# EAGLE design ATtiny prog board with USB (EAGLE 7.3.0)
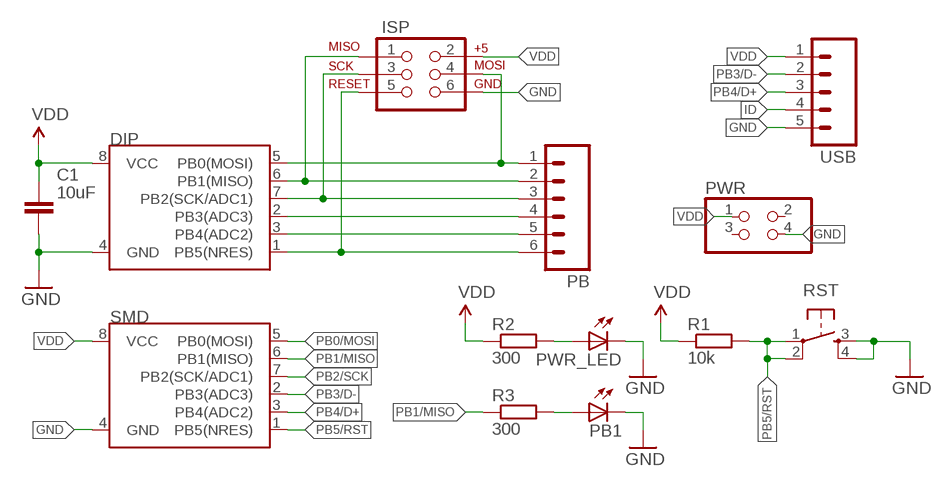
[diagram p0: schematic, sheet 1]

## Parts
C1  10uF  CAPACITOR_NPOL-0805  [C805]
DIP  ATTINY45TINY85-20-DIP  [DIP08]
ISP  AVR_SPI_PRG_6PTH  [2X3]
PB  M06SILK_FEMALE_PTH  [1X06]
PB1  LED-0805  [LED-805]
PWR  PINHD-2X2  [2X02]
PWR_LED  LED-0805  [LED-805]
R1  10k  RESISTOR-0603  [R603]
R2  300  RESISTOR-0603  [R603]
R3  300  RESISTOR-0603  [R603]
RST  TAC_SWITCHPTH  [TACTILE-PTH]
SMD  ATTINY45TINY85-20-SMT  [SO08-EIAJ]
USB  M05PTH  [1X05]

## Nets
GND: C1.2 DIP.4(GND) ISP.6 PB1.C PWR.4 PWR_LED.C RST.3 RST.4 SMD.4(GND) USB.5
ID: USB.4
N$1: PWR_LED.A R2.2
N$2: PB1.A R3.2
PB0/MOSI: DIP.5(PB0(MOSI)) ISP.4 PB.1 SMD.5(PB0(MOSI))
PB1/MISO: DIP.6(PB1(MISO)) ISP.1 PB.2 R3.1 SMD.6(PB1(MISO))
PB2/SCK: DIP.7(PB2(SCK/ADC1)) ISP.3 PB.3 SMD.7(PB2(SCK/ADC1))
PB3/D-: DIP.2(PB3(ADC3)) PB.4 SMD.2(PB3(ADC3)) USB.2
PB4/D+: DIP.3(PB4(ADC2)) PB.5 SMD.3(PB4(ADC2)) USB.3
PB5/RST: DIP.1(PB5(NRES)) ISP.5 PB.6 R1.2 RST.1 RST.2 SMD.1(PB5(NRES))
VDD: C1.1 DIP.8(VCC) ISP.2 PWR.1 R1.1 R2.1 SMD.8(VCC) USB.1
Unconnected: PWR.2 PWR.3

## Library data of the parts
C1 = dp_devices:CAPACITOR_NPOL: Non-Polarized capacitor in various packages
DIP = SparkFun-DigitalIC:ATTINY45: Atmel 8-pin 2/4/8kB flash uC; PROD_ID: IC-09445; VALUE: TINY85-20-DIP
ISP = SparkFun-Connectors:AVR_SPI_PRG_6: AVR ISP 6 Pin This is the reduced ISP connector for AVR programming. Common on Arduino. This footprint will take up less PCB space and can be used with a 10-pin to 6-pin adapter such as SKU: BOB-08508 **Special note about "TEST_POINT" package. The stop mask is on the top side, so if you want your programming test points to be on the bottom of your board, make sure to place this package on the bottom side of the board. This also ensure that the orientation to program from the bottom side will be correct.
PB = SparkFun-Connectors:M06: Header 6 Standard 6-pin 0.1" header. Use with straight break away headers (SKU : PRT-00116), right angle break away headers (PRT-00553), swiss pins (PRT-00743), machine pins (PRT-00117), and female headers (PRT-00115). Molex polarized connector foot print use with SKU : PRT-08094 with associated crimp pins and housings. NOTES ON THE VARIANTS LOCK and LOCK_LONGPADS... This footprint was designed to help hold the alignment of a through-hole component (i.e. 6-pin header) while soldering it into place. You may notice that each hole has been shifted either up or down by 0.005 of an inch from it's more standard position (which is a perfectly straight line). This slight alteration caused the pins (the squares in the middle) to touch the edges of the holes. Because they are alternating, it causes a "brace" to hold the component in place. 0.005 has proven to be the perfect amount of "off-center" position when using our standard breakaway headers. Although looks a little odd when you look at the bare footprint, once you have a header in there, the alteration is very hard to notice. Also,if you push a header all the way into place, it is covered up entirely on the bottom side. This idea of altering the position of holes to aid alignment will be further integrated into the Sparkfun Library for other footprints. It can help hold any component with 3 or more connection pins.; PROD_ID: CONN-08437
PB1 PWR_LED = dp_devices:LED: Light Emitting Diode
PWR = pinhead:PINHD-2X2: PIN HEADER
R1-R3 = dp_devices:RESISTOR
RST = SparkFun-Retired:TAC_SWITCH: Momentary Switch Button commonly used for reset or general input. Spark Fun Electronics SKU : COM-00097 SMT- SWCH-08247
SMD = SparkFun-DigitalIC:ATTINY45: Atmel 8-pin 2/4/8kB flash uC; PROD_ID: IC-09092; VALUE: Tiny85-20-SMT
USB = SparkFun-Connectors:M05: Header 5 Standard 5-pin 0.1" header. Use with straight break away headers (SKU : PRT-00116), right angle break away headers (PRT-00553), swiss pins (PRT-00743), machine pins (PRT-00117), and female headers (PRT-00115). Molex polarized connector foot print use with SKU : PRT-08230 with associated crimp pins and housings.

## Board
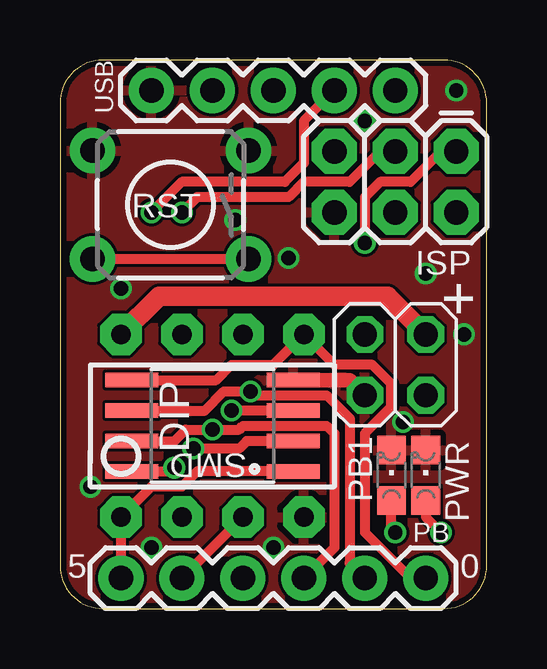
[diagram p1: board, top side]
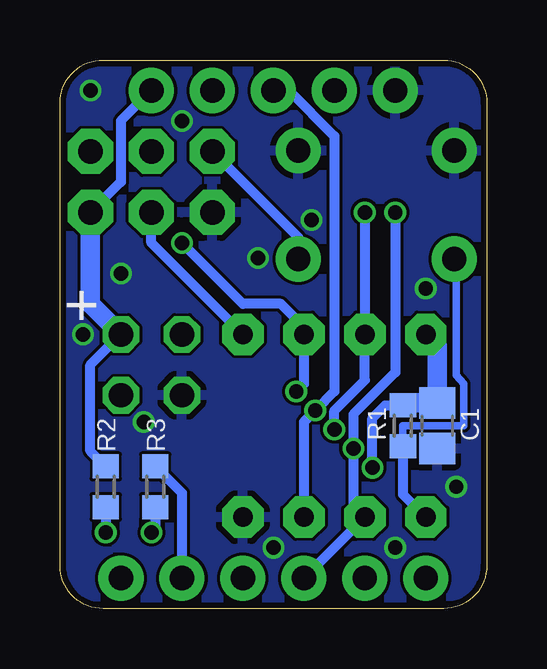
[diagram p2: board, bottom side, seen from below]

Size 17.78 x 22.86 mm. Coordinates in mm from the lower left corner, seen from the top.
Outline: 0,21.06 0,1.8 arc90 1.8,0 15.98,0 arc90 17.78,1.79 17.78,21.07 arc90 15.99,22.86 1.79,22.86 arc90 0,21.06
Copper layers (1*16): Top 0.035mm / dielectric 1.5mm / Bottom 0.035mm
Design rules "dirt_cheap_dirty_boards.v1": minimum track width 5mil, minimum drill 12mil, track to track 5mil, track to pad 5mil, pad to pad 5mil, via to via 5mil, smd to smd 0mil, copper to edge 10mil, drill to drill 10mil, minimum pad ring 10mil, minimum via ring 6mil, stop-mask expansion 2mil, vias tented up to drill 25mil, thermal gap 10mil

### Footprints (pad centres in the part's own frame; a part is rotated, then mirrored left to right if it is on the bottom)
C805 = smd 1.3 x 1.5: 1 -0.95,0; 2 0.95,0
DIP08 = drill 0.813 pad 1.727 octagon: 1 -3.81,-3.81; 2 -1.27,-3.81; 3 1.27,-3.81; 4 3.81,-3.81; 5 3.81,3.81; 6 1.27,3.81; 7 -1.27,3.81; 8 -3.81,3.81
2X3 = drill 1.016 pad 1.88 octagon: 1 0,0; 2 0,2.54; 3 2.54,0; 4 2.54,2.54; 5 5.08,0; 6 5.08,2.54
1X06 = drill 1.016 pad 1.88: 1 0,0; 2 2.54,0; 3 5.08,0; 4 7.62,0; 5 10.16,0; 6 12.7,0
LED-805 = smd 1.2 x 1.2: A 0,-1.05; C 0,1.05
2X02 = drill 1.016 octagon: 1 -1.27,-1.27; 2 -1.27,1.27; 3 1.27,-1.27; 4 1.27,1.27
R603 = smd 1 x 1.1: 1 -0.85,0; 2 0.85,0
TACTILE-PTH = drill 1.016 pad 1.88: 1 -3.251,2.261; 2 3.251,2.261; 3 -3.251,-2.261; 4 3.251,-2.261
SO08-EIAJ = smd 0.61 x 2.21: 1 -1.905,-3.378; 2 -0.635,-3.378; 3 0.635,-3.378; 4 1.905,-3.378; 5 1.905,3.353; 6 0.635,3.353; 7 -0.635,3.353; 8 -1.905,3.353
1X05 = drill 1.016 pad 1.88: 1 0,0; 2 2.54,0; 3 5.08,0; 4 7.62,0; 5 10.16,0

### Placement (x,y rotation side)
C1  2.06,7.62 270 bottom
DIP  6.35,7.62 0 top
ISP  16.51,19.05 180 top
PB  15.24,1.27 180 top
PB1  13.81,5.56 0 top
PWR  13.97,10.16 180 top
PWR_LED  15.24,5.56 0 top
R1  3.49,7.62 270 bottom
R2  15.88,5.08 270 bottom
R3  13.81,5.08 270 bottom
RST  4.6,16.83 180 top
SMD  6.35,7.62 90 top
USB  13.97,21.59 180 top

### Tracks (layer width: path | path; a pad name or v marks a point on that pad's centre or on a via)
GND  (via drill 0.6)
  Top 0.61: SMD.4 12.06,9.53 PWR.4
  other vias: 14.29,7.78 3.81,2.54 8.89,2.54 15.24,13.97 16.83,11.43 2.54,13.34 1.27,5.08 12.7,20.32 16.51,21.59 7.3,16.19 9.53,14.61
  pour Bottom: 0,0 17.78,0 17.78,22.86 0,22.86
  pour Top: 0,0 17.78,0 17.78,22.86 0,22.86
N$1  (via drill 0.6)
  Top 0.406: PWR_LED.A 15.24,3.81 v15.88,3.17
  Bottom 0.406: 15.88,4.29 R2.2 v15.88,3.17
N$2  (via drill 0.6)
  Top 0.406: v13.97,3.17 13.81,3.33 PB1.A
  Bottom 0.406: R3.2 13.81,3.33 v13.97,3.17
PB0/MOSI
  Top 0.406: SMD.5 6.51,9.53 7.14,10.16 8.89,10.16 DIP.5 11.43,10.16 13.02,10.16 13.81,9.37 13.81,8.41 12.7,7.3 12.7,3.17 14.61,1.27 PB.1
  Bottom 0.406: DIP.5 13.97,15.24 ISP.4
PB1/MISO  (via drill 0.6)
  Top 0.406: SMD.6 6.03,8.26 6.83,9.05 v7.94,9.05 8.1,8.89 11.11,8.89 12.06,7.94 12.06,1.91 PB.2 | ISP.1 15.88,19.05 14.61,17.78 13.34,17.78 12.7,17.14 v12.7,15.24
  Bottom 0.406: v7.94,9.05 7.62,9.37 DIP.6 7.62,11.75 8.57,12.7 10.16,12.7 v12.7,15.24 | R3.1 12.7,4.82 PB.2
PB2/SCK  (via drill 0.6)
  Top 0.406: SMD.7 4.76,6.99 5.24,7.46 v6.35,7.46 7.46,7.46 7.62,7.62 11.11,7.62 11.43,7.3 11.43,2.54 PB.3 | ISP.3 13.34,19.05 12.06,17.78 10.16,17.78 9.53,17.14 5.71,17.14 v5.08,16.51
  Bottom 0.406: v6.35,7.46 6.35,8.26 5.08,9.53 DIP.7 v5.08,16.51
PB3/D-  (via drill 0.6)
  Top 0.406: SMD.2 7.78,6.99 7.46,6.67 v5.56,6.67 | USB.2 10.16,20.32 10.16,18.57 9.37,17.78 5.08,17.78 v3.81,16.51
  Bottom 0.406: v3.81,16.51 3.81,9.84 5.56,8.1 v5.56,6.67 5.56,4.29 DIP.2 PB.4
PB4/D+  (via drill 0.6)
  Top 0.406: SMD.3 v7.14,8.26 | PB.5 DIP.3
  Bottom 0.406: USB.3 8.26,21.59 6.35,19.68 6.35,9.05 v7.14,8.26 7.62,7.78 DIP.3
PB5/RST
  Top 0.406: SMD.1 5.71,5.71 5.08,5.08 3.81,5.08 DIP.1 PB.6 | RST.1 RST.2
  Bottom 0.305: R1.2 3.49,7.62 0.95,7.62 0.95,9.37 1.27,9.72 1.27,14.48 RST.2
  Bottom 0.406: R1.2 3.49,4.76 DIP.1 | ISP.5 7.86,15.47 RST.1
VDD  (via drill 0.6)
  Top 0.406: SMD.8 4.6,5.71 v4.76,5.87
  Top 0.813: DIP.8 4.13,13.02 13.65,13.02 PWR.1
  Bottom 0.406: USB.1 15.24,20.32 15.24,17.78 ISP.2 | v4.76,5.87 4.76,7.94 4.23,8.47 R1.1 | PWR.1 16.51,10.16 16.51,6.57 R2.1
  Bottom 0.813: ISP.2 16.51,12.7 PWR.1 | R1.1 3.39,8.57 C1.1 2.06,10.95 DIP.8

### Text on the board
tNames: + | 5 | 0
bNames: +